# Altium schematic sheet main.SchDoc
size A4; Organization: Altium Limited; Address1: L3, 12a Rodborough Rd; Address2: Frenchs Forest; Address3: NSW; Address4: Australia 2086
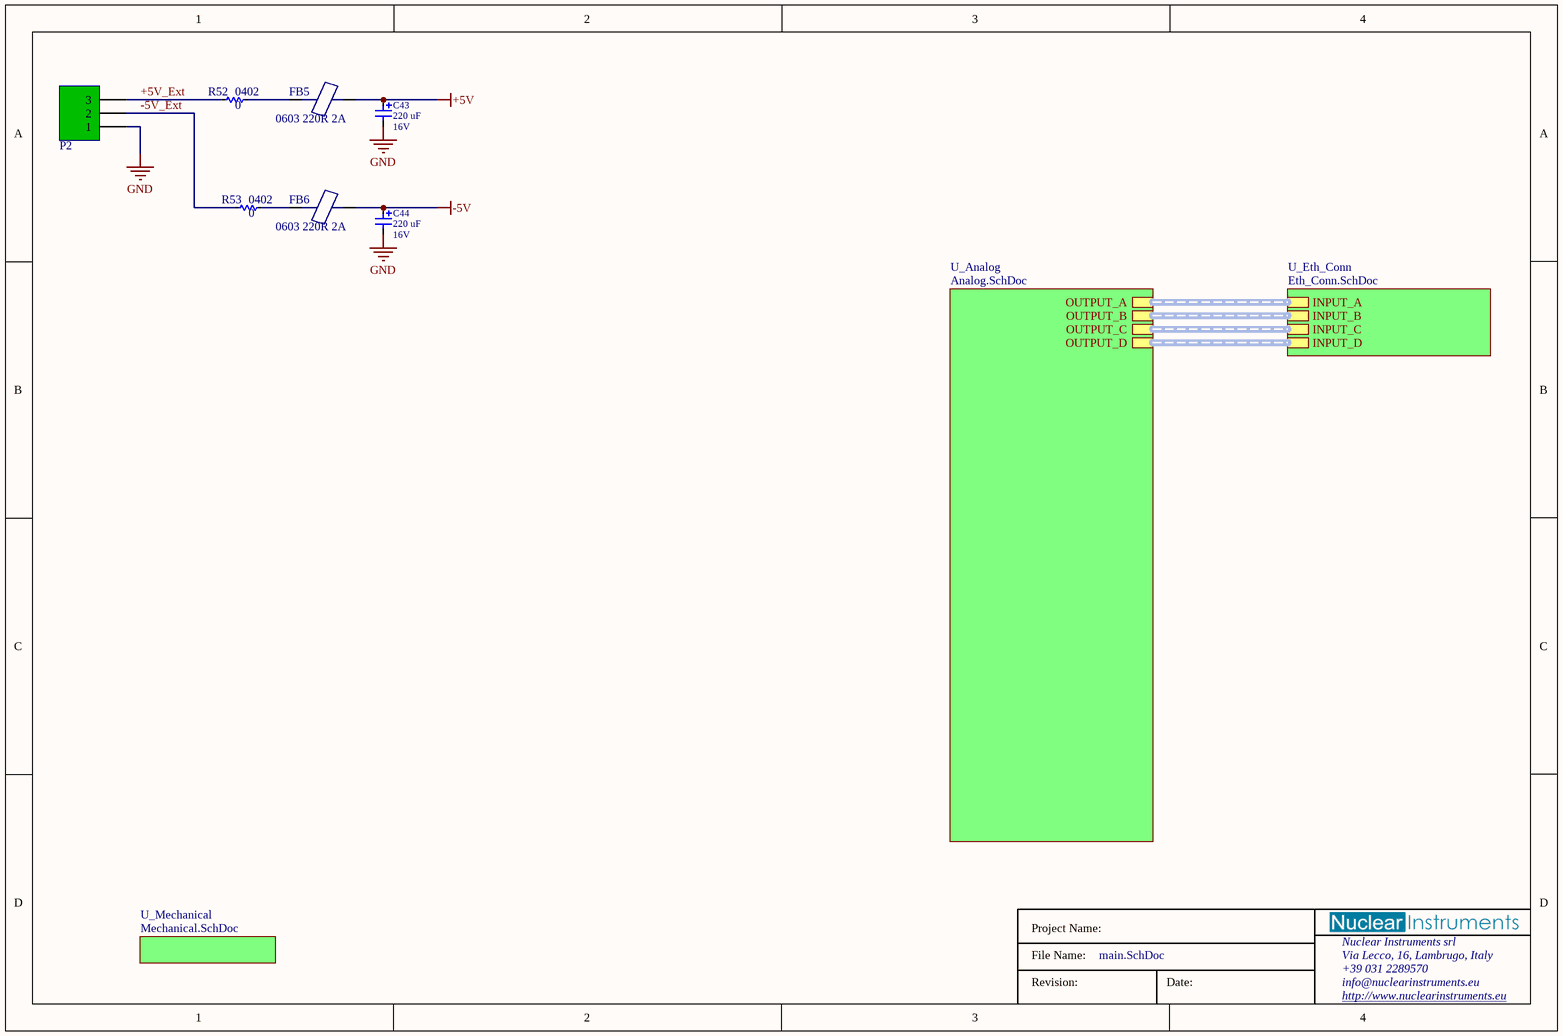
[diagram p0: main.SchDoc]

## Parts
C43  value 220 uF  Voltage: 16V  [CAPELECTSMD_L83_H62]  (hidden comment: CAPELECT)
C44  value 220 uF  Voltage: 16V  [CAPELECTSMD_L83_H62]  (hidden comment: CAPELECT)
FB5  0603 220R 2A  [FERSMD0603]
FB6  0603 220R 2A  [FERSMD0603]
P2  3 way 5.08mm pitch  [Wurth_2135_3way_5.08mm_screw]  (value not drawn)
R52  0402  value 0  [RESSMD0402]
R53  0402  value 0  [RESSMD0402]

## Sub-sheets
U_Analog = Analog.SchDoc: OUTPUT_D (harness 8ch_sig), OUTPUT_C (harness 8ch_sig), OUTPUT_B (harness 8ch_sig), OUTPUT_A (harness 8ch_sig)
U_Eth_Conn = Eth_Conn.SchDoc: INPUT_D (harness 8ch_sig), INPUT_C (harness 8ch_sig), INPUT_B (harness 8ch_sig), INPUT_A (harness 8ch_sig)
U_Mechanical = Mechanical.SchDoc: no entries

## Nets
+5V: C43.1 FB5.2
-5V: C44.1 FB6.2
GND: C43.2 C44.2 P2.1
+5V_Ext: P2.3 R52.1
-5V_Ext: P2.2 R53.1
NetFB5_1: FB5.1 R52.2
NetFB6_1: FB6.1 R53.2

## Buses and harness runs
harness sheet U_Analog/OUTPUT_A = sheet U_Eth_Conn/INPUT_A
harness sheet U_Analog/OUTPUT_B = sheet U_Eth_Conn/INPUT_B
harness sheet U_Analog/OUTPUT_C = sheet U_Eth_Conn/INPUT_C
harness sheet U_Analog/OUTPUT_D = sheet U_Eth_Conn/INPUT_D

## Notes on the sheet
- Project Name:
- Revision:
- File Name:
- Date:
- Nuclear Instruments srl
- Via Lecco, 16, Lambrugo, Italy
- +39 031 2289570
- info@nuclearinstruments.eu
- http://www.nuclearinstruments.eu

## Library data of the parts
C43 C44 = CAPELECT_PANASONIC_L83_H62_FK_16V_220u: Cond. Elettrolitico Allum.220 µF, 16 V; NICode: 00660000026; NIClass: Standard
FB5 FB6 = FER0603_BLM18EG221SN1D_220R: NICode: 00330000195; Value: 220; NIClass: Standard
P2 = Wurth_2135_3way_5.08mm_screw: Serie 2135- 5.08mm Horizontal Entry Modular w. Rising Cage Clamp WR-TBL; NICode: 00280001645; NIClass: Standard
R52 R53 = RES0402-0R: NICode: 00300000186; NIClass: Standard